# EAGLE design CNCAdapter (EAGLE 6.2)
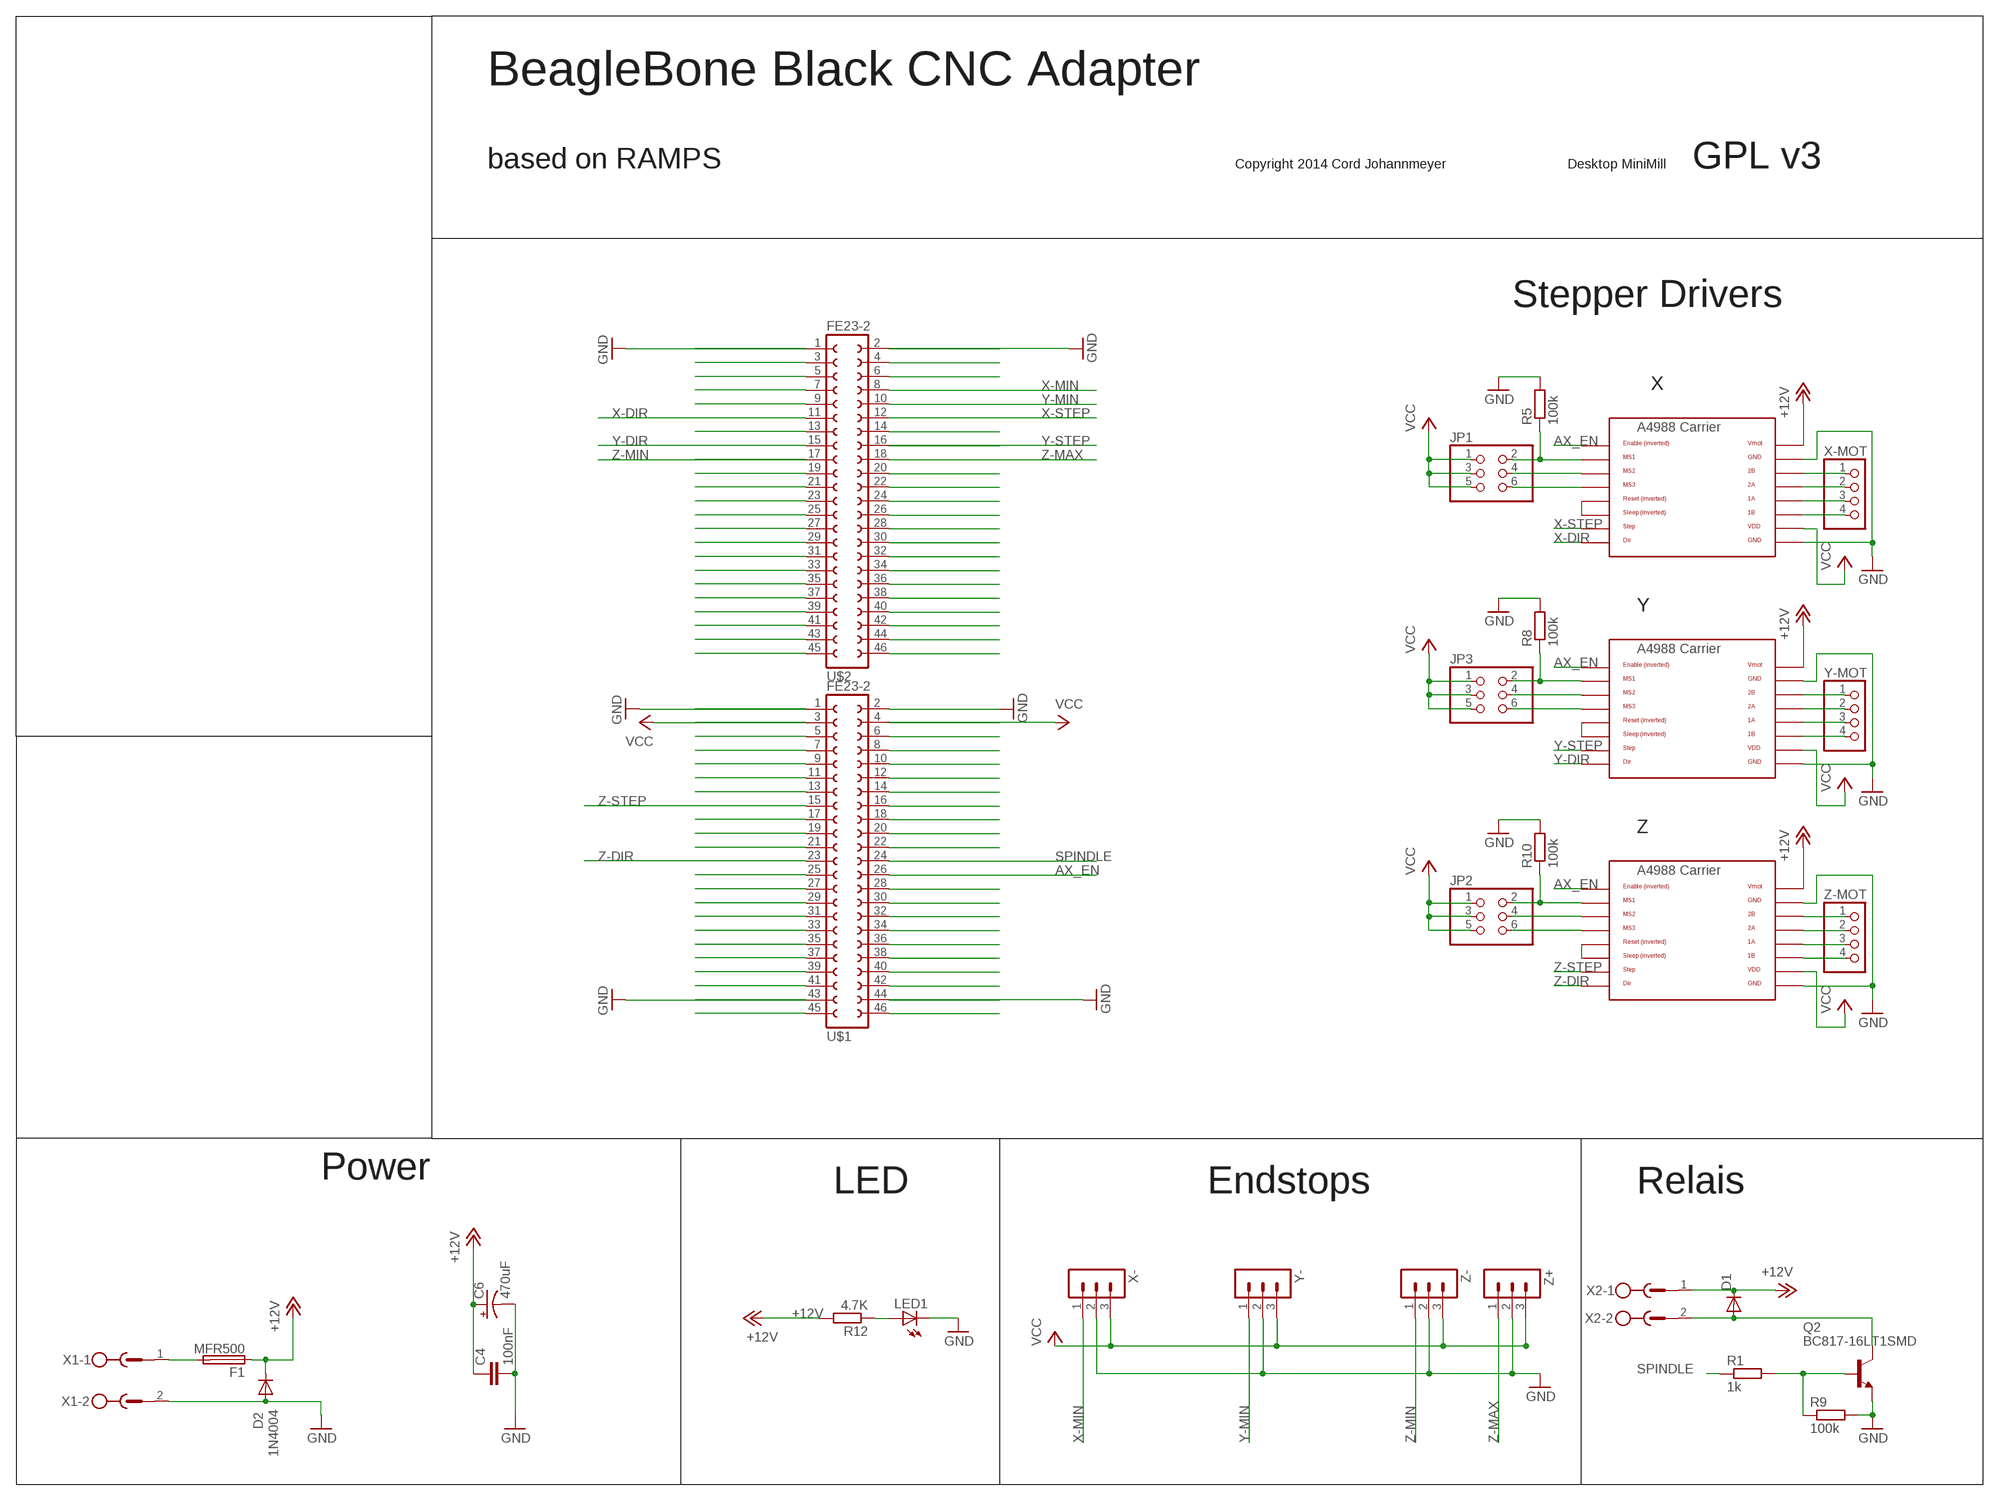
[diagram p0: schematic, sheet 1]

## Parts
C4  100nF  C2,5-3  [C2.5-3]
C6  470uF  CPOL-USE3.5-8  [E3,5-8]
D1  DIODE-MINIMELF  [MINIMELF]
D2  1N4004  [DO41-10]
F1  MFR500  PTCFUSE  [LITTLEFUSE]
JP1  PINHD-2X3  [2X03]
JP2  PINHD-2X3  [2X03]
JP3  PINHD-2X3  [2X03]
LED1  LED3MM  [LED3MM]
Q2  BC817-16LT1SMD  [SOT23-BEC]
R1  1k  R-EU_R0805  [R0805]
R5  100k  R-EU_R0805  [R0805]
R8  100k  R-EU_R0805  [R0805]
R9  100k  R-EU_R0805  [R0805]
R10  100k  R-EU_R0805  [R0805]
R12  4.7K  R-EU_R0805  [R0805]
U$1  FE23-2  [FE23-2]
U$2  FE23-2  [FE23-2]
U$6  A4988BREAKOUT  [A4988BREAKOUT]
U$7  A4988BREAKOUT  [A4988BREAKOUT]
U$8  A4988BREAKOUT  [A4988BREAKOUT]
X1  MSTBV2  [MSTBV2]
X2  MSTBV2  [MSTBV2]
X-  3PIN-HEADER  [3PIN-HEADER]
X-MOT  PINHD-1X4  [1X04]
Y-  3PIN-HEADER  [3PIN-HEADER]
Y-MOT  PINHD-1X4  [1X04]
Z+  3PIN-HEADER  [3PIN-HEADER]
Z-  3PIN-HEADER  [3PIN-HEADER]
Z-MOT  PINHD-1X4  [1X04]

## Nets
+12V: C4.1 C6.+ D1.C D2.C F1.1 R12.2 U$6.VMOT U$7.VMOT U$8.VMOT X2.1
AX_EN: U$1.26 U$6.EN U$7.EN U$8.EN
GND: C4.2 C6.- D2.A LED1.K(C) Q2.E R5.2 R8.2 R9.2 R10.2 U$1.1 U$1.2 U$1.43 U$1.44 U$2.1 U$2.2 U$6.GND U$6.GND@0(GND) U$7.GND U$7.GND@0(GND) U$8.GND U$8.GND@0(GND) X1.2 X-.2 Y-.2 Z+.2 Z-.2
N$1: F1.2 X1.1
N$2: U$2.3
N$3: U$2.5
N$4: U$2.7
N$5: U$2.9
N$6: U$2.13
N$7: D1.A Q2.C X2.2
N$8: U$2.19
N$9: U$2.21
N$10: U$2.23
N$11: U$2.25
N$12: U$2.27
N$13: U$2.29
N$14: JP1.2 R5.1 U$6.MS1
N$15: JP1.4 U$6.MS2
N$16: U$2.31
N$17: JP3.4 U$7.MS2
N$18: U$2.33
N$19: JP1.6 U$6.MS3
N$20: U$6.RST U$6.SLP(SLEEP)
N$21: U$6.2B X-MOT.1
N$22: U$6.2A X-MOT.2
N$23: U$7.RST U$7.SLP(SLEEP)
N$24: U$2.35
N$25: U$2.37
N$26: U$6.1A X-MOT.3
N$27: U$6.1B X-MOT.4
N$28: U$7.2B Y-MOT.1
N$29: U$7.2A Y-MOT.2
N$30: U$7.1A Y-MOT.3
N$31: JP3.6 U$7.MS3
N$32: U$2.39
N$33: JP3.2 R8.1 U$7.MS1
N$34: U$2.41
N$35: U$2.43
N$36: U$7.1B Y-MOT.4
N$37: JP2.4 U$8.MS2
N$38: U$8.RST U$8.SLP(SLEEP)
N$39: JP2.6 U$8.MS3
N$40: JP2.2 R10.1 U$8.MS1
N$41: U$8.2B Z-MOT.1
N$42: U$8.2A Z-MOT.2
N$43: U$8.1A Z-MOT.3
N$44: U$8.1B Z-MOT.4
N$45: U$2.45
N$46: LED1.A R12.1
N$47: U$2.4
N$48: U$2.6
N$49: U$2.14
N$50: U$2.20
N$51: U$2.22
N$52: U$2.24
N$53: U$2.26
N$54: U$2.28
N$55: U$2.30
N$56: U$2.32
N$57: U$2.34
N$58: U$2.36
N$59: U$2.38
N$60: U$2.40
N$61: U$2.42
N$62: U$2.44
N$63: U$2.46
N$65: U$1.6
N$66: U$1.8
N$67: U$1.10
N$68: U$1.12
N$69: U$1.14
N$70: U$1.16
N$71: U$1.18
N$72: U$1.20
N$73: U$1.22
N$74: U$1.28
N$75: U$1.30
N$76: U$1.32
N$77: U$1.34
N$78: U$1.36
N$79: U$1.38
N$80: U$1.40
N$81: U$1.42
N$82: U$1.46
N$83: U$1.5
N$84: U$1.7
N$85: U$1.9
N$86: U$1.11
N$87: U$1.13
N$88: U$1.17
N$89: U$1.19
N$90: U$1.21
N$91: U$1.25
N$92: U$1.27
N$93: U$1.29
N$94: U$1.31
N$95: U$1.33
N$96: U$1.35
N$97: U$1.37
N$98: U$1.39
N$99: U$1.41
N$100: U$1.45
N$101: Q2.B R1.2 R9.1
SPINDLE: R1.1 U$1.24
VCC: JP1.1 JP1.3 JP1.5 JP2.1 JP2.3 JP2.5 JP3.1 JP3.3 JP3.5 U$1.3 U$1.4 U$6.VDD U$7.VDD U$8.VDD X-.3 Y-.3 Z+.3 Z-.3
X-DIR: U$2.11 U$6.DIR
X-MIN: U$2.8 X-.1
X-STEP: U$2.12 U$6.STEP
Y-DIR: U$2.15 U$7.DIR
Y-MIN: U$2.10 Y-.1
Y-STEP: U$2.16 U$7.STEP
Z-DIR: U$1.23 U$8.DIR
Z-MAX: U$2.18 Z+.1
Z-MIN: U$2.17 Z-.1
Z-STEP: U$1.15 U$8.STEP

## Notes on the sheet
- BeagleBone Black CNC Adapter
- based on RAMPS | Copyright 2014 Cord Johannmeyer | Desktop MiniMill | GPL v3
- Stepper Drivers
- X
- Y
- Z
- Power
- LED | Endstops | Relais

## Library data of the parts
C4 = capacitor-wima:C: CAPACITOR naming: grid - package width
C6 = adafruit:CPOL-US: POLARIZED CAPACITOR, American symbol
D1 = diode:DIODE-: DIODE
D2 = diode:1N4004: DIODE general purpose rectifier, 1 A
F1 = RepRapjr:PTCFUSE: LITTLEFUSE Picofuse/slow Littlefuse
JP1-JP3 = pinhead:PINHD-2X3: PIN HEADER
LED1 = led:LED: LED OSRAM: - CHIPLED LG R971, LG N971, LY N971, LG Q971, LY Q971, LO R971, LY R971 LH N974, LH R974 LS Q976, LO Q976, LY Q976 LO Q996 - Hyper CHIPLED LW Q18S LB Q993, LB Q99A, LB R99A - SideLED LS A670, LO A670, LY A670, LG A670, LP A670 LB A673, LV A673, LT A673, LW A673 LH A674 LY A675 LS A676, LA A676, LO A676, LY A676, LW A676 LS A679, LY A679, LG A679 - Hyper Micro SIDELED® LS Y876, LA Y876, LO Y876, LY Y876 LT Y87S - SmartLED LW L88C, LW L88S LB L89C, LB L89S, LG L890 LS L89K, LO L89K, LY L89K LS L896, LA L896, LO L896, LY L896 - TOPLED LS T670, LO T670, LY T670, LG T670, LP T670 LSG T670, LSP T670, LSY T670, LOP T670, LYG T670 LG T671, LOG T671, LSG T671 LB T673, LV T673, LT T673, LW T673 LH T674 LS T676, LA T676, LO T676, LY T676, LB T676, LH T676, LSB T676, LW T676 LB T67C, LV T67C, LT T67C, LS T67K, LO T67K, LY T67K, LW E67C LS E67B, LA E67B, LO E67B, LY E67B, LB E67C, LV E67C, LT E67C LW T67C LS T679, LY T679, LG T679 LS T770, LO T770, LY T770, LG T770, LP T770 LB T773, LV T773, LT T773, LW T773 LH T774 LS E675, LA E675, LY E675, LS T675 LS T776, LA T776, LO T776, LY T776, LB T776 LHGB T686 LT T68C, LB T68C - Hyper Mini TOPLED® LB M676 - Mini TOPLED Santana® LG M470 LS M47K, LO M47K, LY M47K Source: http://www.osram.convergy.de LUXEON: - LUMILED® LXK2-PW12-R00, LXK2-PW12-S00, LXK2-PW14-U00, LXK2-PW14-V00 LXK2-PM12-R00, LXK2-PM12-S00, LXK2-PM14-U00 LXK2-PE12-Q00, LXK2-PE12-R00, LXK2-PE12-S00, LXK2-PE14-T00, LXK2-PE14-U00 LXK2-PB12-K00, LXK2-PB12-L00, LXK2-PB12-M00, LXK2-PB14-N00, LXK2-PB14-P00, LXK2-PB14-Q00 LXK2-PR12-L00, LXK2-PR12-M00, LXK2-PR14-Q00, LXK2-PR14-R00 LXK2-PD12-Q00, LXK2-PD12-R00, LXK2-PD12-S00 LXK2-PH12-R00, LXK2-PH12-S00 LXK2-PL12-P00, LXK2-PL12-Q00, LXK2-PL12-R00 Source: www.luxeon.com KINGBRIGHT: KA-3528ASYC Source: www.kingbright.com
Q2 = transistor-npn:BC817*: NPN Transistor
R1 R5 R8-R10 R12 = rcl:R-EU_: RESISTOR, European symbol
U$1 U$2 = mylib:FE23-2
U$6-U$8 = RepRapjr:A4988BREAKOUT
X1 X2 = con-phoenix-500:MSTBV2: PHOENIX; OC_FARNELL: unknown; OC_NEWARK: unknown
X- Y- Z+ Z- = ultimachine:3PIN-HEADER: PIN HEADER
X-MOT Y-MOT Z-MOT = RepRapjr:PINHD-1X4: PIN HEADER

## Board
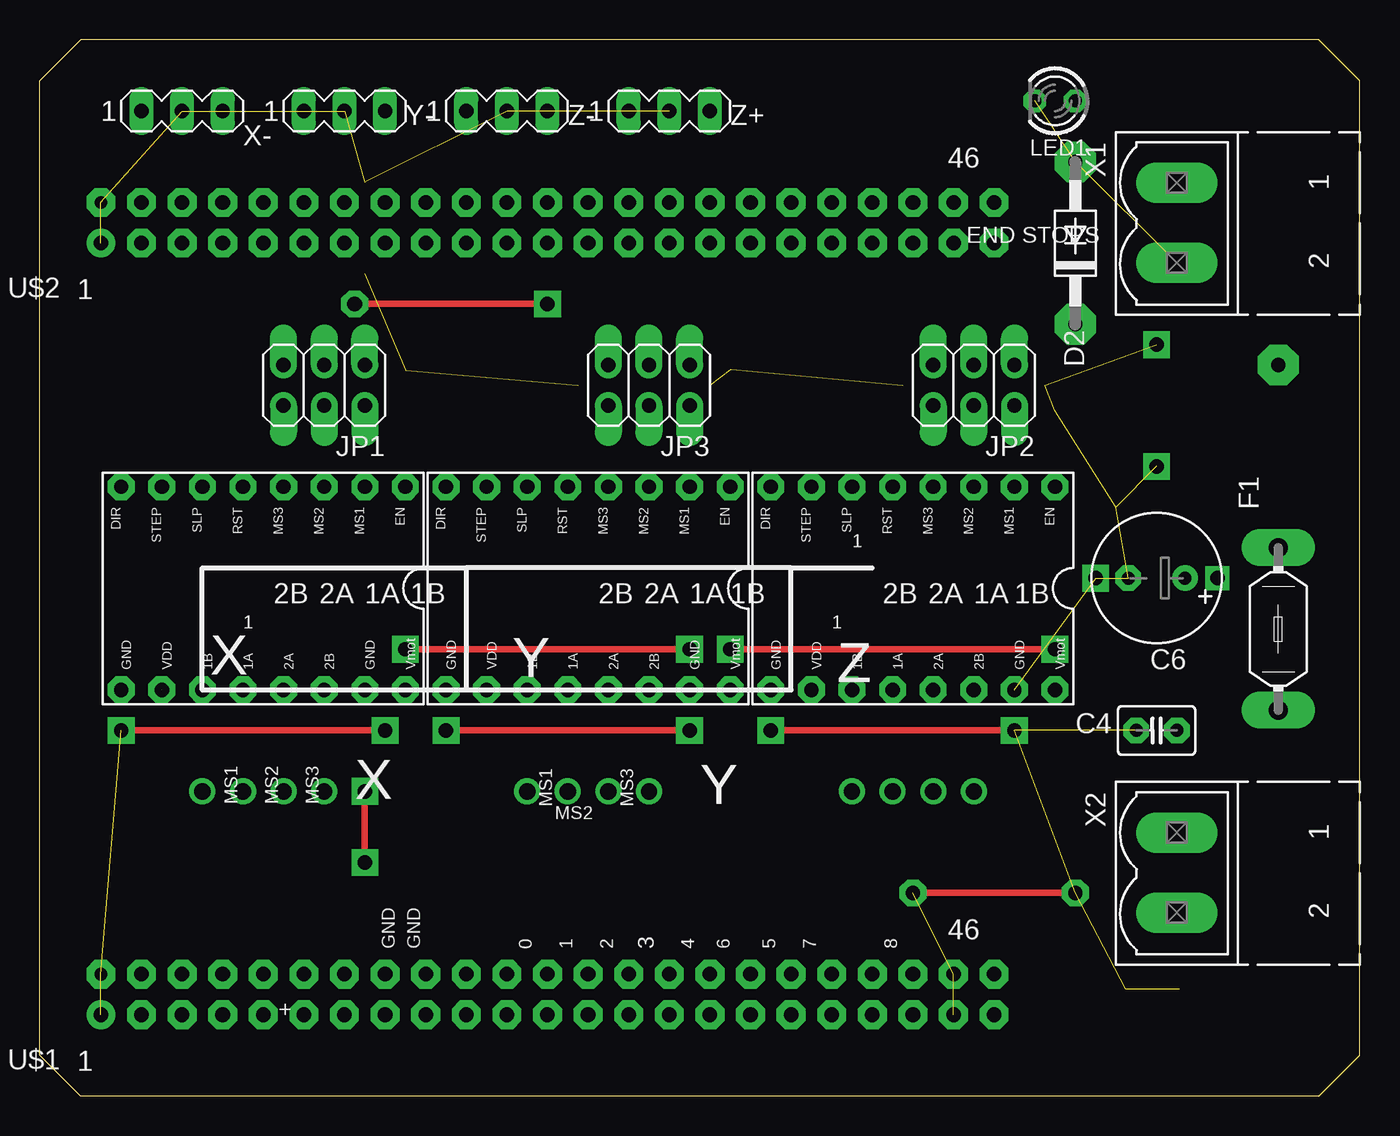
[diagram p1: board, top side]
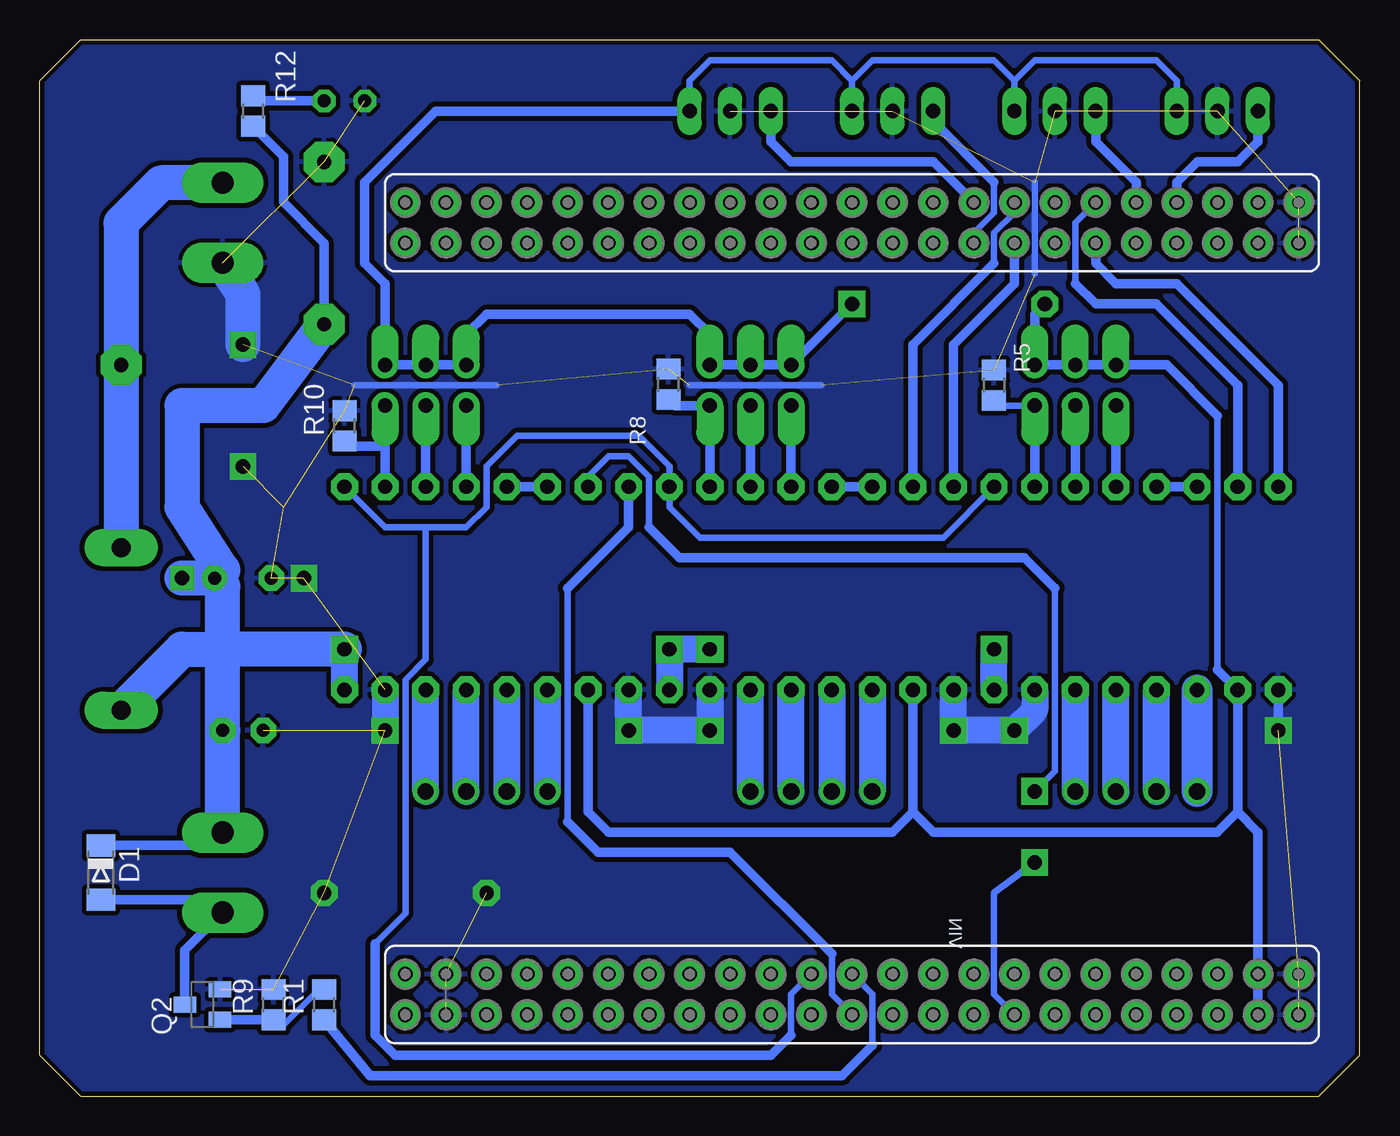
[diagram p2: board, bottom side, seen from below]

Size 82.55 x 66.04 mm. Coordinates in mm from the lower left corner, seen from the top.
Outline: 80.01,0 82.55,2.54 82.55,63.5 80.01,66.04 2.54,66.04 0,63.5 0,2.54 2.54,0 80.01,0
Copper layers (1*16): Top 0.035mm / dielectric 1.5mm / Bottom 0.035mm
Design rules: minimum track width 7mil, minimum drill 15mil, track to track 7mil, track to pad 7mil, pad to pad 7mil, via to via 7mil, smd to smd 7mil, copper to edge 10mil, drill to drill 8mil, minimum pad ring 12mil, minimum via ring 12mil, stop-mask expansion 4mil, vias tented up to drill 25mil, thermal gap 10mil

### Footprints (pad centres in the part's own frame; a part is rotated, then mirrored left to right if it is on the bottom)
C2.5-3 = drill 0.813 pad 1.6 octagon: 1 -1.27,0; 2 1.27,0
E3,5-8 = drill 0.813 pad 1.6: + -1.778,0 | drill 0.813 pad 1.6 octagon: - 1.778,0
MINIMELF = smd 1.4 x 1.8: A 1.7,0; C -1.7,0
DO41-10 = drill 0.9 pad 2.54 octagon: A 5.08,0; C -5.08,0
LITTLEFUSE = drill 1.2 pad 2.3 long: 1 -5.08,0; 2 5.08,0
2X03 = drill 0.9 pad 1.676 offset: 1 -2.54,-1.27; 2 -2.54,1.27; 3 0,-1.27; 4 0,1.27; 5 2.54,-1.27; 6 2.54,1.27
LED3MM = drill 0.813 octagon: A -1.27,0; K 1.27,0
SOT23-BEC = smd 1 x 1.4: B -0.95,-1.1; C 0,1.1; E 0.95,-1.1
R0805 = smd 1.3 x 1.5: 1 -0.95,0; 2 0.95,0
FE23-2 = drill 0.914 pad 1.8: 1 0,0 | drill 0.8 pad 1.8 octagon: 2 0,2.54 | drill 0.914 pad 1.8 octagon: 3 2.54,0; 4 2.54,2.54; 5 5.08,0; 6 5.08,2.54; 7 7.62,0; 8 7.62,2.54; 9 10.16,0; 10 10.16,2.54; 11 12.7,0; 12 12.7,2.54; 13 15.24,0; 14 15.24,2.54; 15 17.78,0; 16 17.78,2.54; 17 20.32,0; 18 20.32,2.54; 19 22.86,0; 20 22.86,2.54; 21 25.4,0; 22 25.4,2.54; 23 27.94,0; 24 27.94,2.54; 25 30.48,0; 26 30.48,2.54; 27 33.02,0; 28 33.02,2.54; 29 35.56,0; 30 35.56,2.54; 31 38.1,0; 32 38.1,2.54; 33 40.64,0; 34 40.64,2.54; 35 43.18,0; 36 43.18,2.54; 37 45.72,0; 38 45.72,2.54; 39 48.26,0; 40 48.26,2.54; 41 50.8,0; 42 50.8,2.54; 43 53.34,0; 44 53.34,2.54; 45 55.88,0; 46 55.88,2.54
A4988BREAKOUT = drill 0.9 pad 1.676 octagon: 1A 8.89,1.27; 1B 11.43,1.27; 2A 6.35,1.27; 2B 3.81,1.27; DIR 16.51,-11.43; EN -1.27,-11.43; GND 16.51,1.27; GND@0 1.27,1.27; MS1 1.27,-11.43; MS2 3.81,-11.43; MS3 6.35,-11.43; RST 8.89,-11.43; SLP 11.43,-11.43; STEP 13.97,-11.43; VDD 13.97,1.27; VMOT -1.27,1.27
MSTBV2 = drill 1.397 pad 2.54 long: 1 -2.5,0; 2 2.5,0
3PIN-HEADER = drill 0.9 pad 1.422 long: 1 -2.54,0; 2 0,0; 3 2.54,0
1X04 = drill 1.016: 1 -2.54,0; 2 0,0; 3 2.54,0; 4 5.08,0

### Placement (x,y rotation side)
C4  69.85,22.86 180 top
C6  69.85,32.38 180 top
D1  78.74,13.97 270 bottom
D2  64.77,53.34 90 top
F1  77.47,29.21 90 top
JP1  17.78,44.45 180 top
JP2  58.42,44.45 180 top
JP3  38.1,44.45 180 top
LED1  63.5,62.23 180 top
Q2  72.39,5.71 90 bottom
R1  64.77,5.71 90 bottom
R5  22.86,44.45 90 bottom
R8  43.24,44.51 90 bottom
R9  67.94,5.71 90 bottom
R10  63.5,41.91 90 bottom
R12  69.22,61.59 270 bottom
U$1  3.81,5.08 0 top
U$2  3.81,53.34 0 top
U$6  21.59,26.67 180 top
U$7  41.91,26.67 180 top
U$8  62.23,26.67 180 top
X1  71.12,54.61 270 top
X2  71.12,13.97 270 top
X-  8.89,61.59 0 top
X-MOT  15.24,19.05 180 top
Y-  19.05,61.59 0 top
Y-MOT  35.56,19.05 180 top
Z+  39.37,61.59 0 top
Z-  29.21,61.59 0 top
Z-MOT  55.88,19.05 180 top

### Tracks (layer width: path | path; a pad name or v marks a point on that pad's centre or on a via)
+12V  (via drill 0.9, 0.9 pad 1.68)
  Top 0.406: v63.5,27.94 v43.18,27.94 | v22.86,27.94 v40.64,27.94
  Bottom 0.406: U$6.VMOT
  Bottom 0.61: D1.C 70.32,15.67 X2.1 | D2.C 64.77,53.34 67.31,55.88 67.31,58.74 R12.2
  Bottom 1.676: U$8.VMOT v63.5,27.94 | U$7.VMOT v43.18,27.94 v40.64,27.94 | U$6.VMOT v22.86,27.94
  Bottom 2.184: X2.1 C4.1 71.12,27.94 | v63.5,27.94 71.12,27.94 | F1.1 73.66,27.94 71.12,27.94 | 71.12,27.94 71.12,31.88 C6.+ | D2.C 68.58,43.18 73.66,43.18 73.66,36.83 71.12,32.89 C6.+ | C6.+ v73.66,32.38
AX_EN
  Bottom 0.406: U$1.26 35.56,6.35 35.56,3.81 | 58.42,35.56 55.88,35.56 54.61,36.83 54.61,39.37 52.7,41.27 45.09,41.27 43.18,39.37 U$7.EN 43.18,36.83 41.27,34.92 26.04,34.92 U$6.EN | U$8.EN 60.96,35.56 58.42,35.56 | U$6.EN | 61.59,9.53 59.69,11.43 59.69,26.04 58.42,27.3 58.42,35.56
  Bottom 0.61: 35.56,3.81 36.83,2.54 60.33,2.54 61.59,3.81 61.59,9.53
GND  (via drill 0.9 pad 1.68)  (29 unrouted)
  Top 0.406: v60.96,22.86 v45.72,22.86 | v40.64,22.86 v25.4,22.86 | v21.59,22.86 v5.08,22.86 | v54.61,12.7 v64.77,12.7
  Bottom 0.406: 20.32,57.15 20.32,51.44 | 41.91,44.45 33.66,44.45 | 53.98,44.45 62.87,44.45 | U$6.GND
  Bottom 0.61: v5.08,22.86 U$6.GND
  Bottom 1.676: U$8.GND@0 v60.96,22.86 | U$8.GND v45.72,22.86 v40.64,22.86 U$7.GND@0 | U$7.GND v25.4,22.86 v21.59,22.86 20.32,24.13 U$6.GND@0
  Bottom 2.184: v69.85,46.99 69.85,50.16 71.12,52.07
  other vias: 66.04,32.38 69.85,39.37
  pour Bottom (isolate 0.305): 0,63.5 2.54,66.04 80.01,66.04 82.55,63.5 82.55,2.54 80.01,0 2.54,0 0,2.54
N$1  (via drill 0.9 pad 2.54)
  Bottom 2.184: X1.1 74.97,57.11 77.47,54.61 v77.47,45.72 F1.2
N$7
  Bottom 0.61: D1.A 70.32,12.27 X2.2 73.49,9.1 Q2.C
N$14
  Bottom 0.406: JP1.2 22.54,43.18 R5.1 | U$6.MS1
  Bottom 0.61: JP1.2 U$6.MS1
N$15
  Bottom 0.406: U$6.MS2
  Bottom 0.61: JP1.4 U$6.MS2
N$17
  Bottom 0.61: JP3.4 U$7.MS2
N$19
  Bottom 0.406: 15.24,40.64
  Bottom 0.61: U$6.MS3 15.24,40.64 JP1.6
N$20
  Bottom 0.61: U$6.SLP U$6.RST
N$21
  Bottom 0.406: U$6.2B
  Bottom 1.676: X-MOT.1 U$6.2B
N$22
  Bottom 0.406: U$6.2A
  Bottom 1.676: X-MOT.2 U$6.2A
N$23
  Bottom 0.61: U$7.SLP U$7.RST
N$26
  Bottom 0.406: U$6.1A
  Bottom 1.676: X-MOT.3 U$6.1A
N$27
  Bottom 0.406: U$6.1B
  Bottom 1.93: X-MOT.4 U$6.1B
N$28
  Bottom 1.676: Y-MOT.1 U$7.2B
N$29
  Bottom 1.676: Y-MOT.2 U$7.2A
N$30
  Bottom 1.676: U$7.1A Y-MOT.3
N$31
  Bottom 0.61: JP3.6 U$7.MS3
N$33
  Bottom 0.406: 42.86,43.18 R8.1
  Bottom 0.61: U$7.MS1 JP3.2 42.86,43.18
N$36
  Bottom 1.676: U$7.1B Y-MOT.4
N$37
  Bottom 0.61: U$8.MS2 JP2.4
N$38
  Bottom 0.61: U$8.SLP U$8.RST
N$39
  Bottom 0.61: JP2.6 U$8.MS3
N$40
  Bottom 0.406: 63.18,40.64 R10.1
  Bottom 0.61: 60.96,40.64 U$8.MS1 | JP2.2 60.96,40.64 | 60.96,40.64 63.18,40.64
N$41
  Bottom 1.676: Z-MOT.1 U$8.2B
N$42
  Bottom 1.676: Z-MOT.2 U$8.2A
N$43
  Bottom 1.676: Z-MOT.3 U$8.1A
N$44
  Bottom 1.676: Z-MOT.4 U$8.1B
N$46
  Bottom 0.406: 68.9,62.23 R12.1
  Bottom 0.61: LED1.A 68.9,62.23
N$101
  Bottom 0.406: 71.06,4.99 Q2.B | R1.2 65.09,6.67 67.31,4.45 67.62,4.45 R9.1
  Bottom 0.61: R9.1 Q2.B
SPINDLE
  Bottom 0.406: U$1.24 30.48,6.35 30.48,3.17
  Bottom 0.61: 30.48,3.17 32.38,1.27 61.91,1.27 R1.1
VCC  (via drill 0.91 pad 1.68)  (1 unrouted)
  Top 0.406: v19.68,49.53 v31.75,49.53
  Bottom 0.406: 7.62,17.78 U$6.VDD | U$6.VDD | 8.89,26.67 8.89,42.55 | X-.3 11.43,63.5 12.7,64.77 20.32,64.77 21.59,63.5 | Y-.3 21.59,63.5 | 21.59,63.5 22.86,64.77 30.48,64.77 31.75,63.5 | Z-.3 31.75,63.5 | 31.75,63.5 33.02,64.77 40.64,64.77 41.91,63.5 Z+.3
  Bottom 0.61: U$1.3 U$1.4 6.35,16.51 7.62,17.78 | 7.62,17.78 U$6.VDD 8.89,26.67 | 7.62,17.78 8.89,16.51 26.67,16.51 27.94,17.78 | 27.94,17.78 U$7.VDD | U$8.VDD 48.26,17.78 46.99,16.51 29.21,16.51 27.94,17.78 | Z+.3 57.78,61.59 62.23,57.15 62.23,52.07 60.96,50.8 JP2.1 JP2.3 JP2.5 55.88,47.62 54.61,48.9 41.91,48.9 40.64,47.62 JP3.1 JP3.3 JP3.5 v31.75,49.53 | 8.89,42.55 12.06,45.72 JP1.5 JP1.3 JP1.1 20.32,48.9 v19.68,49.53
X-DIR
  Bottom 0.61: U$6.DIR 5.08,44.45 11.43,50.8 15.24,50.8 16.51,52.07 U$2.11
X-MIN
  Bottom 0.61: X-.1 6.35,59.69 7.62,58.42 10.16,58.42 11.43,57.15 U$2.8
X-STEP
  Bottom 0.406: 17.78,50.8 17.78,54.61 U$2.12
  Bottom 0.61: U$6.STEP 7.62,44.45 12.7,49.53 16.51,49.53 17.78,50.8
Y-DIR
  Bottom 0.61: U$2.15 21.59,50.8 25.4,46.99 U$7.DIR
Y-MIN
  Bottom 0.61: U$2.10 13.97,57.15 16.51,59.69 Y-.1
Y-STEP
  Bottom 0.406: U$2.16 21.59,55.24 22.86,53.98 22.86,52.07
  Bottom 0.61: 22.86,52.07 27.94,46.99 U$7.STEP
Z-DIR
  Bottom 0.406: U$1.23 33.02,6.35 33.02,8.89 | 49.53,17.14 49.53,31.75
  Bottom 0.61: 33.02,8.89 39.37,15.24 47.62,15.24 49.53,17.14 | 49.53,31.75 45.72,35.56 U$8.DIR
Z-MAX
  Bottom 0.61: U$2.18 26.67,58.42 35.56,58.42 36.83,59.69 Z+.1
Z-MIN
  Bottom 0.406: U$2.17 24.13,53.98 22.86,55.24 22.86,57.15
  Bottom 0.61: 22.86,57.15 26.67,60.96 Z-.1
Z-STEP  (via drill 0.9 pad 1.68)
  Top 0.406: v20.32,19.05 v20.32,14.61
  Bottom 0.406: U$8.STEP 48.26,38.73 46.99,40.01 45.72,40.01 44.45,38.73 44.45,35.56 | 19.05,31.75 19.05,20.32 v20.32,19.05 | v20.32,14.61 22.86,12.7 22.86,6.35 U$1.15
  Bottom 0.61: 44.45,35.56 42.55,33.66 20.95,33.66 19.05,31.75

### Text on the board
tNames: 2B | 2A | 1A | 1B | 2B | 2A | 1A | 1B | 2B | 2A | 1A | 1B | MS1 | MS2 | MS3 | MS1 | MS2 | MS3 | GND | GND | 0 | 1 | 2 | 3 | 4 | 6 | 5 | 7 | 8
bNames: VIN
Document: GPL v3 | 12-35VDC In | + | 11A | -
Title: BeagleBone Black CNC Adapter
_tsilk: END STOPS | 1 | 1 | 1 | X | Y | Z | X | Y | +